# Altium schematic sheet peripherals.SchDoc
size A4
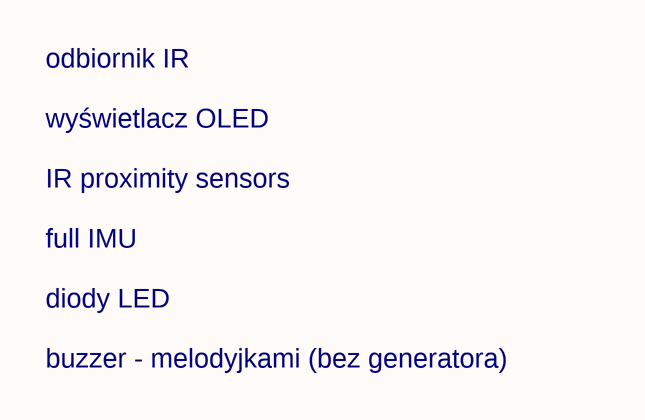
[diagram p0: peripherals.SchDoc]

## Notes on the sheet
- odbiornik IR
- wyświetlacz OLED
- IR proximity sensors
- full IMU
- diody LED
- buzzer - melodyjkami (bez generatora)